# Altium schematic sheet ADC_INPUT_BIAS.SchDoc
size 393 x 281 mm; PageSetup: Record=PageOptions|CenterHorizontal=True|CenterVertical=True|PrintScale=0.94|XCorrection=0.00|YCorrection=0.00|PrintKind=0|BorderSize=5000000|LeftOffset=0|BottomOffset=0|Orientation=2|PaperLength=1000|PaperWidth=1000|Scale=100|PaperSource=15|PrintQuality=600|MediaType=1|DitherType=10|PrintScaleMode=1|PaperKind=A4; Adr1: August Barks gata 6B; Adr2: SE-421 32 Västra Frölunda; Adr3: Sweden; Webpage: www.omnisys.se
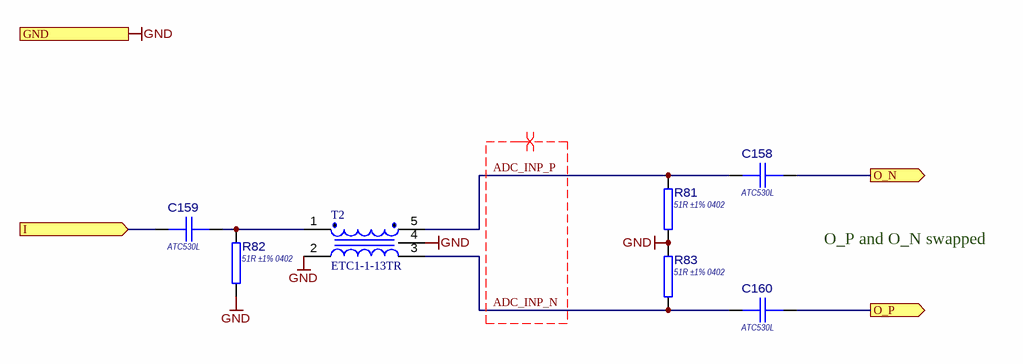
[diagram p0: ADC_INPUT_BIAS.SchDoc]

## Parts
C158  ATC530L  [CAPC1005X06L]
C159  ATC530L  [CAPC1005X06L]
C160  ATC530L  [CAPC1005X06L]
R81  51R ±1% 0402  [RESC1005L]
R82  51R ±1% 0402  [RESC1005L]
R83  51R ±1% 0402  [RESC1005L]
T2  ETC1-1-13TR  [SOTFL50P160X73-3N]

## Ports
GND, I (in), O_N (out), O_P (out)

## Nets
GND: R81.1 R82.2 R83.2 T2.2(Primary) T2.4(NC) ; port GND
ADC_INP_N: C160.2 R83.1 T2.3(Secondary)
ADC_INP_P: C158.2 R81.2 T2.5(Secondary_dot)
I: C159.2 ; port I
O_N: C158.1 ; port O_N
O_P: C160.1 ; port O_P
NetC159_1: C159.1 R82.1 T2.1(Primary_dot)

## Layout directives
differential pair; rule Differential Pairs Routing [Pref Gap = 0.2mm    Min Gap  = 0.2mm    Max Gap  = 0.2mmPref Width = 0.3mm    Min Width  = 0.3mm    Max Width  = 0.3mm]; net class DiffPairs_Input: ADC_INP_N, ADC_INP_P

## Notes on the sheet
- O_P and O_N swapped
- Title:
- SVN:
- August Barks gata 6B
- SE-421 32 Västra Frölunda
- Omnisys Instruments AB
- PCB ASY:
- PCB:
- SVN Folder:
- www.omnisys.se
- Page:
- of
- Print date:
- Page size:
- A3
- Information contained in this drawing is confidential. Copying, distributing or use in any matter, other than that specified by OMNISYS INSTRUMENTS AB, is strictly prohibited.

## Library data of the parts
C158-C160 = CMP-0300-000000-1: 100n 16V ±15% 0402 (1005 metric) ATC530L104KT16T; Case-EIA: 0402; Case-Metric: 1005; Dielectric: X7R; OmnisysBuy: False; Maximum working voltage: 16V; Tolerance: ±15%; Technology: SMT
R81-R83 = CMP-1800-001397-2: 51R ±1% ±100 ppm/˚C 0.05W 50V 0402 (1005 metric); Value: 51.00; Power: 0.10W; Case-EIA: 0402; Case-Metric: 1005; Tolerance: 1; Temp. Coefficent: ±100; Maximum working voltage: 50V; Technology: SMT
T2 = CMP-00002-1: Transformers Audio & Signal 4.5-3000MHz IL 2dB Impedance Ratio 1:1; Power Rating: 250mW; Max DC Current: 30mA; Max Operating Temperature: 85°C; Lead Free: Contains Lead; Radiation Hardening: No; Package Quantity: 2000; Min Operating Temperature: -40°C; Turns Ratio: 1:1; Length: 3.81mm; Height: 2.67mm; Mount: Surface Mount; Termination: SMD/SMT; Width: 3.81mm; Case/Package: SMD/SMT; Number of Pins: 5; Packaging: Tape and Reel; Depth: 3.81mm